# Altium schematic sheet Ethernet.SchDoc
size 381 x 241 mm; SheetNumber: 3; SheetTotal: 4; SPICEModelCacheIATZBDIJ: <root> / <DocumentId>IATZBDIJ</DocumentId> / </root>
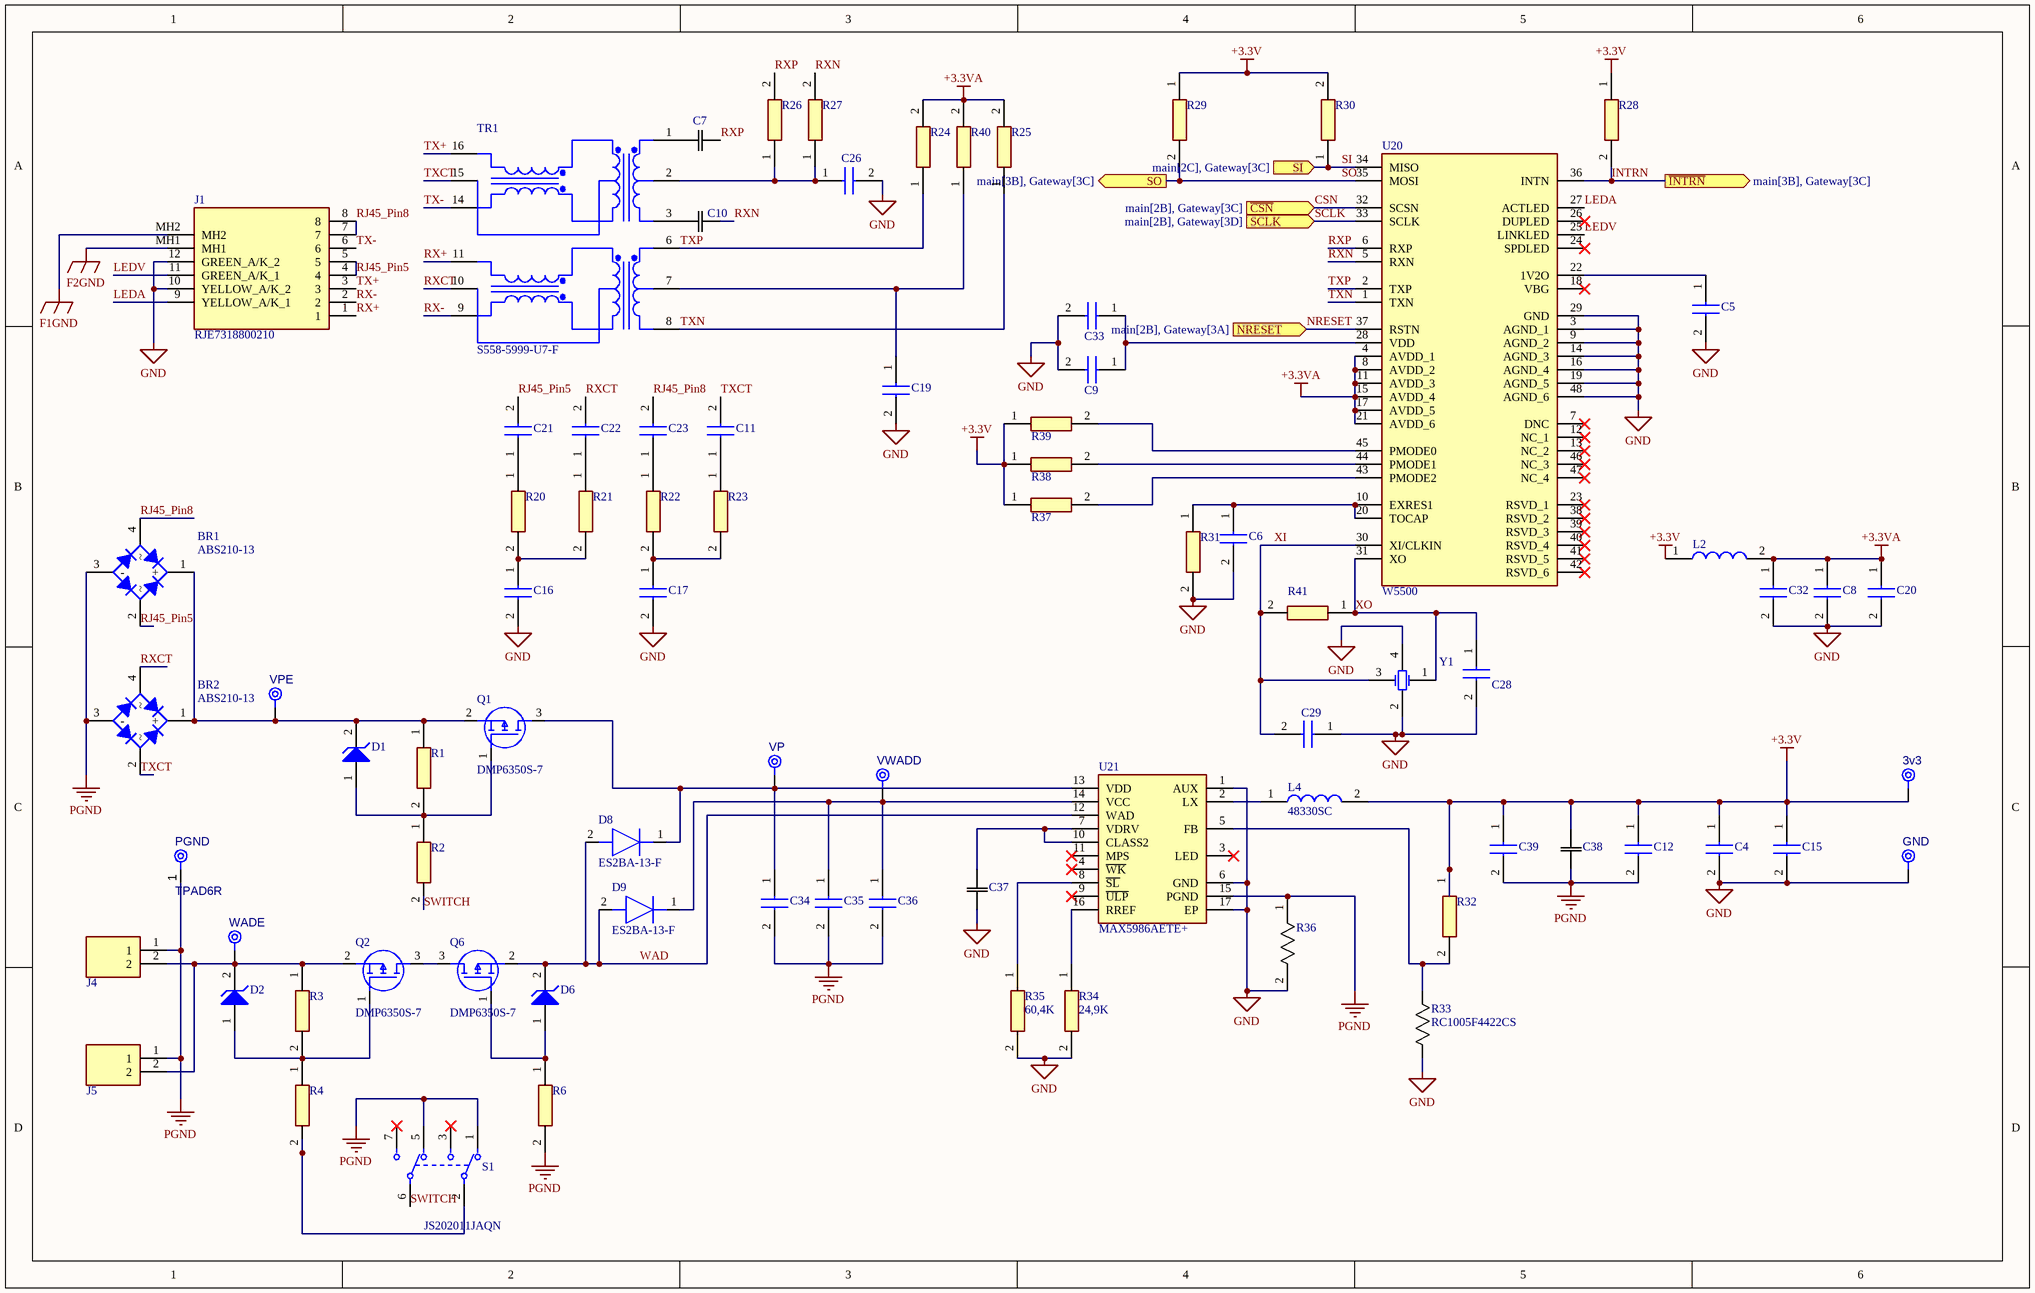
[diagram p0: Ethernet.SchDoc]

## Parts
3v3  TPAD6R  [TP06R]  (value not drawn)  (no BOM)
BR1  ABS210-13  [ABS21013]
BR2  ABS210-13  [ABS21013]
C4  C1005X7R1C104KT  [CAPC1005X55N]  (value not drawn)
C5  CL05B103KO5NNNC  [CAPC1005X55N]  (value not drawn)
C6  JMK105BC6475MV-F  [CAPC1006X65N]  (value not drawn)
C7  CL05X105KP5NNNC  [CAP_CL05_SAM]  (value not drawn)
C8  C1005X7R1C104KT  [CAPC1005X55N]  (value not drawn)
C9  C1005X7R1C104KT  [CAPC1005X55N]  (value not drawn)
C10  CL05X105KP5NNNC  [CAP_CL05_SAM]  (value not drawn)
C11  C1608JB2A223M080AA  [C1608_Commercial]  (value not drawn)
C12  C1005X7R1C104KT  [CAPC1005X55N]  (value not drawn)
C15  CL05A106MP8NUB8  [CAPC1005X90N]  (value not drawn)
C16  CL31B102KJHNNNE  [CAPC3216X180N]  (value not drawn)
C17  CL31B102KJHNNNE  [CAPC3216X180N]  (value not drawn)
C19  GRM155R71H223KA12D  [GRM15x]  (value not drawn)
C20  CL05B103KO5NNNC  [CAPC1005X55N]  (value not drawn)
C21  C1608JB2A223M080AA  [C1608_Commercial]  (value not drawn)
C22  C1608JB2A223M080AA  [C1608_Commercial]  (value not drawn)
C23  C1608JB2A223M080AA  [C1608_Commercial]  (value not drawn)
C26  C1005X5R1E104K050BC  [CAPC1005X55N]  (value not drawn)
C28  C1005C0G1H150JT  [CAPC1005X55N]  (value not drawn)
C29  C1005C0G1H150JT  [CAPC1005X55N]  (value not drawn)
C32  JMK105BC6475MV-F  [CAPC1006X65N]  (value not drawn)
C33  JMK105BC6475MV-F  [CAPC1006X65N]  (value not drawn)
C34  CC0805KKX7R0BB683  [CAPC2012X145N]  (value not drawn)
C35  CL21Y105KCYVPNE  [CAPC2012X145N]  (value not drawn)
C36  GRM32ER71J106KA12L  [CAPC3225X270N]  (value not drawn)
C37  CL05X105KP5NNNC  [CAP_CL_05_SAM]  (value not drawn)
C38  CL05X105KP5NNNC  [CAP_CL_05_SAM]  (value not drawn)
C39  GRM21BR61A476ME15L  [CAPC2012X145N]  (value not drawn)
D1  MMSZ5240B-7-F  [SOD3716X145N]  (value not drawn)
D2  MMSZ5240B-7-F  [SOD3716X145N]  (value not drawn)
D6  MMSZ5240B-7-F  [SOD3716X145N]  (value not drawn)
D8  ES2BA-13-F  [DIOM5226X230N]
D9  ES2BA-13-F  [DIOM5226X230N]
GND  TPAD6R  [TP06R]  (value not drawn)  (no BOM)
J1  RJE7318800210  [RJE7318800210]
J4  OQ0232510000G  [OQ0232510000G]  (value not drawn)
J5  OQ0232510000G  [OQ0232510000G]  (value not drawn)
L2  FBMH1608HM101-T  [INDC1608X90N]  (value not drawn)
L4  48330SC  [48101SC]
PGND  TPAD6R  [TP06R]  (no BOM)
Q1  DMP6350S-7  [SOT96P240X110-3N]
Q2  DMP6350S-7  [SOT96P240X110-3N]
Q6  DMP6350S-7  [SOT96P240X110-3N]
R1  R0402_1%_100_K__RC0402FR-07100KL_  [RESC1005X40N]  (value not drawn)
R2  R0402_1%_100_K__RC0402FR-07100KL_  [RESC1005X40N]  (value not drawn)
R3  R0402_1%_100_K__RC0402FR-07100KL_  [RESC1005X40N]  (value not drawn)
R4  R0402_1%_100_K__RC0402FR-07100KL_  [RESC1005X40N]  (value not drawn)
R6  R0402_1%_100_K__RC0402FR-07100KL_  [RESC1005X40N]  (value not drawn)
R20  RC0603FR-0775RL  [RESC1608X55N]  (value not drawn)
R21  RC0603FR-0775RL  [RESC1608X55N]  (value not drawn)
R22  RC0603FR-0775RL  [RESC1608X55N]  (value not drawn)
R23  RC0603FR-0775RL  [RESC1608X55N]  (value not drawn)
R24  RC0402FR-0749R9L  [RESC1005X40N]  (value not drawn)
R25  RC0402FR-0749R9L  [RESC1005X40N]  (value not drawn)
R26  RC0402FR-0782RL  [RESC1005X40N]  (value not drawn)
R27  RC0402FR-0782RL  [RESC1005X40N]  (value not drawn)
R28  RC0402FR-074K7L  [RESC1005X40N]  (value not drawn)
R29  RC0402FR-074K7L  [RESC1005X40N]  (value not drawn)
R30  RC0402FR-074K7L  [RESC1005X40N]  (value not drawn)
R31  RC0402FR-0712K4L  [RESC1005X40N]  (value not drawn)
R32  RC0402FR-0775KL  [RESC1005X40N]  (value not drawn)
R33  RC1005F4422CS  [RES_1005_SAM-M]
R34  value 24,9K  [RESC1005X40N]  (hidden comment: RC0402FR-0724K9L)
R35  value 60,4K  [RESC1005X40N]  (hidden comment: RC0402FR-0760K4L)
R36  RC0805JR-070RL  [CAPC2012X60N]  (value not drawn)
R37  RC0402FR-0710KL  [RESC1005X40N]  (value not drawn)
R38  RC0402FR-0710KL  [RESC1005X40N]  (value not drawn)
R39  RC0402FR-0710KL  [RESC1005X40N]  (value not drawn)
R40  RC0402FR-0710RL  [RESC1005X40N]  (value not drawn)
R41  RC0402FR-071ML  [RESC1005X40N]  (value not drawn)
S1  JS202011JAQN  [C&K_0_MFG]
TR1  S558-5999-U7-F  [SOIC127P920X571-16N]
U20  W5500  [QFP50P900X900X160-48N]
U21  MAX5986AETE+  [QFN80P500X500X80-17N]
VP  TPAD6R  [TP06R]  (value not drawn)  (no BOM)
VPE  TPAD6R  [TP06R]  (value not drawn)  (no BOM)
VWADD  TPAD6R  [TP06R]  (value not drawn)  (no BOM)
WADE  TPAD6R  [TP06R]  (value not drawn)  (no BOM)
Y1  RH100-25.000-12-F-1010-TR  [RH1002500012F1010TR]  (value not drawn)

## Ports
NRESET (in, see main[2B], Gateway[3A]), SCLK (in, see main[2B], Gateway[3D]), SI (in, see main[2C], Gateway[3C]), SO (out, see main[3B], Gateway[3C]), ~{CSN} (in, see main[2B], Gateway[3C]), ~{INTRN} (out, see main[3B], Gateway[3C])

## Nets
+3.3V: 3v3.1(TP) C4.1 C12.1 C15.1 C38.2 C39.1 L2.1 L4.2 R28.1 R29.1 R30.2 R32.1 R37.1 R38.1 R39.1
+3.3VA: C8.1 C20.1 C32.1 L2.2 R24.2 R25.2 R40.2 U20.4(AVDD_1) U20.8(AVDD_2) U20.11(AVDD_3) U20.15(AVDD_4) U20.17(AVDD_5) U20.21(AVDD_6)
F1GND: J1.MH2
F2GND: J1.MH1
GND: C4.2 C5.2 C6.2 C8.2 C9.2 C15.2 C16.2 C17.2 C19.2 C20.2 C26.2 C28.2 C29.1 C32.2 C33.2 C37.1 GND.1(TP) J1.10(YELLOW_A/K_2) J1.12(GREEN_A/K_2) R31.2 R33.1 R34.2 R35.2 R36.2 U20.3(AGND_1) U20.9(AGND_2) U20.14(AGND_3) U20.16(AGND_4) U20.19(AGND_5) U20.29(GND) U20.48(AGND_6) U21.1(AUX) U21.6(GND) U21.17(EP) Y1.2(NC_1) Y1.4(NC_2)
PGND: BR1.3(-) BR2.3(-) C12.2 C34.2 C35.2 C36.2 C38.1 C39.2 J4.1 J5.1 PGND.1(TP) R6.2 R36.1 S1.1 S1.5 U21.15(PGND)
CSN: U20.32(SCSN) ; port ~{CSN}
INTRN: R28.2 U20.36(INTN) ; port ~{INTRN}
LEDA: J1.9(YELLOW_A/K_1) U20.27(ACTLED)
LEDV: J1.11(GREEN_A/K_1) U20.25(LINKLED)
NRESET: U20.37(RSTN) ; port NRESET
RJ45_Pin5: BR1.2 C21.2 J1.4 J1.5
RJ45_Pin8: BR1.4 C23.2 J1.7 J1.8
RX+: J1.1 TR1.11(RX+)
RX-: J1.2 TR1.9(RX-)
RXCT: BR2.4 C22.2 TR1.10(RXCT)
RXN: C10.2 R27.2 U20.5(RXN)
RXP: C7.2 R26.2 U20.6(RXP)
SCLK: U20.33(SCLK) ; port SCLK
SI: R30.1 U20.34(MISO) ; port SI
SO: R29.2 U20.35(MOSI) ; port SO
SWITCH: R2.2 S1.6(2_C)
TX+: J1.3 TR1.16(TX+)
TX-: J1.6 TR1.14(TX-)
TXCT: BR2.2 C11.2 TR1.15(TXCT)
TXN: R25.1 TR1.8(RD-) U20.1(TXN)
TXP: R24.1 TR1.6(RD+) U20.2(TXP)
WAD: D6.2(A) D8.2(A) D9.2(A) Q6.2(S) U21.12(WAD)
XI: C29.2 R41.2 U20.30(XI/CLKIN) Y1.3(CRYSTAL_2)
XO: C28.1 R41.1 U20.31(XO) Y1.1(CRYSTAL_1)
NetBR1_1: BR1.1(+) BR2.1(+) D1.2(A) Q1.2(S) R1.1 VPE.1(TP)
NetC5_1: C5.1 U20.22(1V2O)
NetC6_1: C6.1 R31.1 U20.10(EXRES1) U20.20(TOCAP)
NetC7_1: C7.1 TR1.1(TD+)
NetC9_1: C9.1 C33.1 U20.28(VDD)
NetC10_1: C10.1 TR1.3(TD-)
NetC11_1: C11.1 R23.1
NetC16_1: C16.1 R20.2 R21.2
NetC17_1: C17.1 R22.2 R23.2
NetC19_1: C19.1 R40.1 TR1.7(RDCT)
NetC21_1: C21.1 R20.1
NetC22_1: C22.1 R21.1
NetC23_1: C23.1 R22.1
NetC26_1: C26.1 R26.1 R27.1 TR1.2(TDCT)
NetC34_1: C34.1 D8.1(K) Q1.3(D) U21.13(VDD) VP.1(TP)
NetC35_1: C35.1 C36.1 D9.1(K) U21.14(VCC) VWADD.1(TP)
NetC37_2: C37.2 U21.7(VDRV) U21.10(CLASS2)
NetD1_1: D1.1(K) Q1.1(G) R1.2 R2.1
NetD2_1: D2.1(K) Q2.1(G) R3.2 R4.1
NetD2_2: D2.2(A) J4.2 J5.2 Q2.2(S) R3.1 WADE.1(TP)
NetD6_1: D6.1(K) Q6.1(G) R6.1
NetL4_1: L4.1 U21.2(LX)
NetQ2_3: Q2.3(D) Q6.3(D)
NetR4_2: R4.2 S1.2(1_C)
NetR32_2: R32.2 R33.2 U21.5(FB)
NetR34_1: R34.1 U21.16(RREF)
NetR35_1: R35.1 U21.8(~{SL})
NetR37_2: R37.2 U20.43(PMODE2)
NetR38_2: R38.2 U20.44(PMODE1)
NetR39_2: R39.2 U20.45(PMODE0)

Not connected (* = marked no-connect by the designer): S1 3* 7*; U20 7(DNC)* 12(NC_1)* 13(NC_2)* 18(VBG)* 23(RSVD_1)* 24(SPDLED)* 26(DUPLED)* 38(RSVD_2)* 39(RSVD_3)* 40(RSVD_4)* 41(RSVD_5)* 42(RSVD_6)* 46(NC_3)* 47(NC_4)*; U21 3(LED)* 4(~{WK})* 9(~{ULP})* 11(MPS)*

## Library data of the parts
3v3 GND PGND VP VPE VWADD WADE = CMP-00028-00002-2: 0.6mm round; Pins: 1
BR1 BR2 = ABS210-13: Bridge Rectifier; Manufacturer_Name: Diodes Incorporated; Datasheet Link: https://www.diodes.com/assets/Datasheets/ABS210.pdf; Height: 1.7mm; Manufacturer_Part_Number: ABS210-13; Mouser Part Number: 621-ABS210-13; Mouser Price/Stock: https://www.mouser.co.uk/ProductDetail/Diodes-Incorporated/ABS210-13?qs=5aG0NVq1C4xM%2FxRR9dyQBQ%3D%3D; Arrow Part Number: ABS210-13; Arrow Price/Stock: https://www.arrow.com/en/products/abs210-13/diodes-incorporated?region=nac
C4 C12 = C1005X7R1C104KT: Capacitor; Manufacturer_Name: TDK; Datasheet Link: https://product.tdk.com/en/system/files?file=dam/doc/product/capacitor/ceramic/mlcc/specification/mlccspec_commercial_general_midvoltage_en.pdf; Height: 0.55mm; Manufacturer_Part_Number: C1005X7R1C104KT; Mouser Part Number: N/A; Mouser Price/Stock: https://www.mouser.co.uk/ProductDetail/TDK/C1005X7R1C104KT?qs=cdpe0LUyr8DJnVp5QbU7dQ%3D%3D
C5 C20 = CL05B103KO5NNNC: Capacitor 10n; Manufacturer_Name: SAMSUNG; Datasheet Link: https://mouser.componentsearchengine.com/Datasheets/2/CL05B103KO5NNNC.pdf; Height: 0.55mm; Manufacturer_Part_Number: CL05B103KO5NNNC; Mouser Part Number: N/A; Mouser Price/Stock: https://www.mouser.co.uk/ProductDetail/Samsung-Electro-Mechanics/CL05B103KO5NNNC?qs=349EhDEZ59r%252BGo7Nl8uX3w%3D%3D; Arrow Part Number: CL05B103KO5NNNC; Arrow Price/Stock: https://www.arrow.com/en/products/cl05b103ko5nnnc/samsung-electro-mechanics
C6 C32 C33 = JMK105BC6475MV-F: Capacitor 4,7u; Manufacturer_Name: TAIYO YUDEN; Datasheet Link: https://componentsearchengine.com/Datasheets/2/JMK105BC6475MV-F.pdf; Height: 0.65mm; Manufacturer_Part_Number: JMK105BC6475MV-F; Mouser Part Number: 963-JMK105BC6475MV-F; Mouser Price/Stock: https://www.mouser.co.uk/ProductDetail/Taiyo-Yuden/JMK105BC6475MV-F?qs=drgMNd%252BkGPOdMbU7ypNm%2FA%3D%3D
C7 C10 C38 = CL05X105KP5NNNC: No Description Available; Mfr_Name: Samsung
C8 C9 = C1005X7R1C104KT: Capacitor 100n; Manufacturer_Name: TDK; Datasheet Link: https://product.tdk.com/en/system/files?file=dam/doc/product/capacitor/ceramic/mlcc/specification/mlccspec_commercial_general_midvoltage_en.pdf; Height: 0.55mm; Manufacturer_Part_Number: C1005X7R1C104KT; Mouser Part Number: N/A; Mouser Price/Stock: https://www.mouser.co.uk/ProductDetail/TDK/C1005X7R1C104KT?qs=cdpe0LUyr8DJnVp5QbU7dQ%3D%3D
C11 C21-C23 = C1608JB2A223M080AA: Capacitor; Manufacturer_Name: TDK; Datasheet Link: https://product.tdk.com/system/files/dam/doc/product/capacitor/ceramic/mlcc/catalog/mlcc_commercial_midvoltage_en.pdf; Height: 0.9mm; Manufacturer_Part_Number: C1608JB2A223M080AA; Mouser Part Number: 810-C1608JB2A223M08A; Mouser Price/Stock: https://www.mouser.co.uk/ProductDetail/TDK/C1608JB2A223M080AA?qs=xLDY6iXSiQb47Cqd%252BoHJag%3D%3D
C15 = CL05A106MP8NUB8: Capacitor 10u; Manufacturer_Name: SAMSUNG; Datasheet Link: https://datasheet.datasheetarchive.com/originals/distributors/DKDS-19/372904.pdf; Height: 0.9mm; Manufacturer_Part_Number: CL05A106MP8NUB8; Mouser Part Number: 187-CL05A106MP8NUB8; Mouser Price/Stock: https://www.mouser.co.uk/ProductDetail/Samsung-Electro-Mechanics/CL05A106MP8NUB8?qs=W0yvOO0ixfHmpNLt1Po66A%3D%3D; Arrow Part Number: CL05A106MP8NUB8; Arrow Price/Stock: https://www.arrow.com/en/products/cl05a106mp8nub8/samsung-electro-mechanics?region=nac
C16 C17 = CL31B102KJHNNNE: Capacitor; Manufacturer_Name: SAMSUNG; Datasheet Link: https://www.tme.com/Document/4a42202b32dab16128fe107dd69598cc/samsung-chip-cap.pdf; Height: 1.8mm; Manufacturer_Part_Number: CL31B102KJHNNNE; Mouser Part Number: 187-CL31B102KJHNNNE; Mouser Price/Stock: https://www.mouser.co.uk/ProductDetail/Samsung-Electro-Mechanics/CL31B102KJHNNNE?qs=X6jEic%2FHinAYVHtIjHgytw%3D%3D; Arrow Part Number: CL31B102KJHNNNE; Arrow Price/Stock: https://www.arrow.com/en/products/cl31b102kjhnnne/samsung-electro-mechanics?region=nac
C19 = GRM155R71H223KA12D: Capacitor; Manufacturer_Name: Murata Electronics; Datasheet Link: https://search.murata.co.jp/Ceramy/image/img/A01X/G101/ENG/GRM155R71H223KA12-01A.pdf; Height: 0.5mm; Manufacturer_Part_Number: GRM155R71H223KA12D; Mouser Part Number: 81-GRM155R71H223KA12; Mouser Price/Stock: https://www.mouser.co.uk/ProductDetail/Murata-Electronics/GRM155R71H223KA12D?qs=Dfh4SrgScWyE65FKEkixtw%3D%3D; Arrow Part Number: GRM155R71H223KA12D; Arrow Price/Stock: https://www.arrow.com/en/products/grm155r71h223ka12d/murata-manufacturing?region=nac
C26 = C1005X5R1E104K050BC: Capacitor; Manufacturer_Name: TDK; Datasheet Link: https://product.tdk.com/info/en/catalog/datasheets/mlcc_commercial_midvoltage_en.pdf; Height: 0.55mm; Manufacturer_Part_Number: C1005X5R1E104K050BC; Mouser Part Number: 810-C1005X5R1E104K; Mouser Price/Stock: https://www.mouser.co.uk/ProductDetail/TDK/C1005X5R1E104K050BC?qs=dfay7wIA1uGgFjZlp3mTxQ%3D%3D; Arrow Part Number: C1005X5R1E104K050BC; Arrow Price/Stock: https://www.arrow.com/en/products/c1005x5r1e104k050bc/tdk
C28 C29 = CC0402JRNPO9BN150: Capacitor 15pF; Manufacturer_Name: YAGEO; Datasheet Link: https://4donline.ihs.com/images/VipMasterIC/IC/YAGO/YAGO-S-A0012506047/YAGO-S-A0012506047-1.pdf?hkey=6D3A4C79FDBF58556ACFDE234799DDF0; Height: 0.55mm; Manufacturer_Part_Number: CC0402JRNPO9BN150
C34 = CC0805KKX7R0BB683: Capacitor 0,068u; Manufacturer_Name: YAGEO; Datasheet Link: https://www.yageo.com/upload/media/product/products/datasheet/mlcc/UPY-NP0X7R_MV_100-to-630V_21.pdf; Height: 1.45mm; Manufacturer_Part_Number: CC0805KKX7R0BB683; Mouser Part Number: 603-CC0805KR0BB683; Mouser Price/Stock: https://www.mouser.co.uk/ProductDetail/YAGEO/CC0805KKX7R0BB683?qs=mzRxyRlhVdtSvrGWLiLEAA%3D%3D
C35 = CL21Y105KCYVPNE: Capacitor; Manufacturer_Name: SAMSUNG; Datasheet Link: https://product.samsungsem.com/mlcc/basic-search.do?partNumber=CL21Y105KCYVPN; Height: 1.45mm; Manufacturer_Part_Number: CL21Y105KCYVPNE
C36 = GRM32ER71J106KA12L: Capacitor 10u; Manufacturer_Name: Murata Electronics; Datasheet Link: http://psearch.en.murata.com/capacitor/product/GRM32ER71E226KE15%23.pdf; Height: 2.7mm; Manufacturer_Part_Number: GRM32ER71J106KA12L; Mouser Part Number: 81-GRM32ER71J106KA2L; Mouser Price/Stock: https://www.mouser.co.uk/ProductDetail/Murata-Electronics/GRM32ER71J106KA12L?qs=eeBpzGFlv%252B%2FlkjOiPI7fBw%3D%3D; Arrow Part Number: GRM32ER71J106KA12L; Arrow Price/Stock: https://www.arrow.com/en/products/grm32er71j106ka12l/murata-manufacturing?region=nac
C37 = CL05X105KP5NNNC: 1u; Mfr_Name: Samsung
C39 = GRM21BR61A476ME15L: Capacitor; Manufacturer_Name: Murata Electronics; Datasheet Link: http://www.murata.com/~/media/webrenewal/support/library/catalog/products/capacitor/mlcc/c02e.pdf; Height: 1.45mm; Manufacturer_Part_Number: GRM21BR61A476ME15L; Mouser Part Number: 81-GRM21BR61A476ME5L; Mouser Price/Stock: https://www.mouser.co.uk/ProductDetail/Murata-Electronics/GRM21BR61A476ME15L?qs=hNud%2FORuBR2%2FEB7WUpdltg%3D%3D; Arrow Part Number: GRM21BR61A476ME15L; Arrow Price/Stock: https://www.arrow.com/en/products/grm21br61a476me15l/murata-manufacturing?region=nac
D1 D2 D6 = MMSZ5240B-7-F: D2; Manufacturer_Name: Diodes Incorporated; Datasheet Link: https://www.diodes.com//assets/Datasheets/ds18010.pdf; Height: 1.45mm; Manufacturer_Part_Number: MMSZ5240B-7-F; Mouser Part Number: 621-MMSZ5240B-F; Mouser Price/Stock: https://www.mouser.co.uk/ProductDetail/Diodes-Incorporated/MMSZ5240B-7-F?qs=t7uQ6EWLCAAZaK0TvRbq0A%3D%3D; Arrow Part Number: MMSZ5240B-7-F; Arrow Price/Stock: https://www.arrow.com/en/products/mmsz5240b-7-f/diodes-incorporated?region=nac
D8 D9 = ES2BA-13-F: Diode; Manufacturer_Name: Diodes Incorporated; Datasheet Link: https://www.diodes.com/assets/Datasheets/ds14002.pdf; Height: 2.3mm; Manufacturer_Part_Number: ES2BA-13-F; Mouser Part Number: 621-ES2BA-F; Mouser Price/Stock: https://www.mouser.co.uk/ProductDetail/Diodes-Incorporated/ES2BA-13-F?qs=VEnr2Ndo2sLuOIbJ1qj2iA%3D%3D; Arrow Part Number: ES2BA-13-F; Arrow Price/Stock: https://www.arrow.com/en/products/es2ba-13-f/diodes-incorporated?region=nac
J1 = RJE7318800210: Connector; Manufacturer_Name: Amphenol Communications Solutions; Datasheet Link: https://cdn.amphenol-cs.com/media/wysiwyg/files/drawing/rje7318800xxx0x.pdf; Height: 11.25mm; Manufacturer_Part_Number: RJE7318800210; Mouser Part Number: 523-RJE7318800210; Mouser Price/Stock: https://www.mouser.co.uk/ProductDetail/Amphenol-Commercial-Products/RJE7318800210?qs=vNmQ2AR%252BfFXMNLPGGmTUSA%3D%3D; Arrow Part Number: RJE7318800210; Arrow Price/Stock: https://www.arrow.com/en/products/rje7318800210/amphenol
J4 J5 = OQ0232510000G: Connector; Manufacturer_Name: Amphenol; Datasheet Link: https://datasheet.datasheetarchive.com/originals/distributors/DKDS-11/219802.pdf; Height: 7.5mm; Manufacturer_Part_Number: OQ0232510000G; Mouser Part Number: 649-220110-D021A01LF; Mouser Price/Stock: https://www.mouser.co.uk/ProductDetail/Amphenol-Anytek/OQ0232510000G?qs=Mv7BduZupUhls3kYL4ZmhA%3D%3D; Arrow Part Number: OQ0232510000G; Arrow Price/Stock: https://www.arrow.com/en/products/oq0232510000g/amphenol?region=nac
L2 = FBMH1608HM101-T: Ferrite Bead; Manufacturer_Name: TAIYO YUDEN; Datasheet Link: https://ds.yuden.co.jp/TYCOMPAS/ut/detail?pn=FBMH1608HM101-T  &u=M; Height: 0.9mm; Manufacturer_Part_Number: FBMH1608HM101-T; Mouser Part Number: 963-FBMH1608HM101-T; Mouser Price/Stock: https://www.mouser.co.uk/ProductDetail/TAIYO-YUDEN/FBMH1608HM101-T?qs=I6KAKw0tg2x7mZxNTOSJ2Q%3D%3D; Arrow Part Number: FBMH1608HM101-T; Arrow Price/Stock: https://www.arrow.com/en/products/fbmh1608hm101-t/taiyo-yuden?region=nac
L4 = 48101SC: Inductor; Manufacturer_Name: Murata Electronics; Datasheet Link: https://datasheet.datasheetarchive.com/originals/distributors/Datasheets_SAMA/421810913ab0fa5fe67b295e06f329e3.pdf; Height: 6mm; Manufacturer_Part_Number: 48101SC; Mouser Part Number: 580-48101SC; Mouser Price/Stock: https://www.mouser.co.uk/ProductDetail/Murata-Power-Solutions/48101SC?qs=ocmcTMnGEDjPRa4zRiyoIQ%3D%3D; Arrow Part Number: 48101SC; Arrow Price/Stock: https://www.arrow.com/en/products/48101sc/murata-power-solutions?region=nac
Q1 Q2 Q6 = DMP6350S-7: MOSFET (P-Channel); Manufacturer_Name: Diodes Incorporated; Datasheet Link: https://www.diodes.com//assets/Datasheets/DMP6350S.pdf; Height: 1.1mm; Manufacturer_Part_Number: DMP6350S-7; Mouser Part Number: 621-DMP6350S-7; Mouser Price/Stock: https://www.mouser.co.uk/ProductDetail/Diodes-Incorporated/DMP6350S-7?qs=rN85NNvew%2FSA9agMyymcZg%3D%3D; Arrow Part Number: DMP6350S-7; Arrow Price/Stock: https://www.arrow.com/en/products/dmp6350s-7/diodes-incorporated?utm_currency=USD&region=nac
R1-R4 R6 = R0402_1%_100_K__RC0402FR-07100KL_: Resistor 100k; Manufacturer_Name: YAGEO; Manufacturer_Part_Number: R0402 1% 100 K (RC0402FR-07100KL); Datasheet Link: https://www.yageo.com/upload/media/product/products/datasheet/rchip/PYu-RC_Group_51_RoHS_L_12.pdf; Height: 0.4mm
R20-R23 = RC0603FR-0775RL: Resistor; Manufacturer_Name: KEMET; Datasheet Link: http://www.yageo.com/documents/recent/PYu-RC0603_51_RoHS_L_v5.pdf; Height: 0.55mm; Manufacturer_Part_Number: RC0603FR-0775RL; Mouser Part Number: 603-RC0603FR-0775RL; Mouser Price/Stock: https://www.mouser.co.uk/ProductDetail/YAGEO/RC0603FR-0775RL?qs=NEN%2FsE%2FLsvOyCMLfQoUEYg%3D%3D; Arrow Part Number: RC0603FR-0775RL; Arrow Price/Stock: https://www.arrow.com/en/products/rc0603fr-0775rl/yageo?region=europe
R24 R25 = RC0402FR-0749R9L: Resistor 49,9 ohms; Manufacturer_Name: YAGEO; Datasheet Link: https://www.yageo.com/upload/media/product/productsearch/datasheet/rchip/PYu-RC_Group_51_RoHS_L_12.pdf; Height: 0.4mm; Manufacturer_Part_Number: RC0402FR-0749R9L; Mouser Part Number: 603-RC0402FR-0749R9L; Mouser Price/Stock: https://www.mouser.co.uk/ProductDetail/YAGEO/RC0402FR-0749R9L?qs=lywS2nZzkrJ8zCaO%252B%252Bic5Q%3D%3D; Arrow Part Number: RC0402FR-0749R9L; Arrow Price/Stock: https://www.arrow.com/en/products/rc0402fr-0749r9l/yageo?region=nac
R26 R27 = RC0402FR-0782RL: Resistor; Manufacturer_Name: KEMET; Datasheet Link: http://www.yageo.com/documents/recent/PYu-RC0402_51_RoHS_L_6_r.pdf; Height: 0.4mm; Manufacturer_Part_Number: RC0402FR-0782RL; Mouser Part Number: 603-RC0402FR-0782RL; Mouser Price/Stock: https://www.mouser.com/Search/Refine.aspx?Keyword=603-RC0402FR-0782RL
R28 R29 = RC0402FR-074K7L: Resistor 4,7K; Manufacturer_Name: KEMET; Datasheet Link: http://www.yageo.com/documents/recent/PYu-RC0402_51_RoHS_L_6_r.pdf; Height: 0.4mm; Manufacturer_Part_Number: RC0402FR-074K7L; Mouser Part Number: 603-RC0402FR-074K7L; Mouser Price/Stock: https://www.mouser.co.uk/ProductDetail/YAGEO/RC0402FR-074K7L?qs=V1yeUXFNrkn%2FmCXC8N8TTA%3D%3D; Arrow Part Number: RC0402FR-074K7L; Arrow Price/Stock: https://www.arrow.com/en/products/rc0402fr-074k7l/yageo
R30 = RC0402FR-074K7L: Resistor 4,7 K; Manufacturer_Name: KEMET; Datasheet Link: http://www.yageo.com/documents/recent/PYu-RC0402_51_RoHS_L_6_r.pdf; Height: 0.4mm; Manufacturer_Part_Number: RC0402FR-074K7L; Mouser Part Number: 603-RC0402FR-074K7L; Mouser Price/Stock: https://www.mouser.co.uk/ProductDetail/YAGEO/RC0402FR-074K7L?qs=V1yeUXFNrkn%2FmCXC8N8TTA%3D%3D; Arrow Part Number: RC0402FR-074K7L; Arrow Price/Stock: https://www.arrow.com/en/products/rc0402fr-074k7l/yageo
R31 = RC0402FR-0712K4L: Resistor 12,4K; Manufacturer_Name: KEMET; Datasheet Link: http://www.yageo.com/documents/recent/PYu-RC0402_51_RoHS_L_6_r.pdf; Height: 0.4mm; Manufacturer_Part_Number: RC0402FR-0712K4L; Mouser Part Number: 603-RC0402FR-0712K4L; Mouser Price/Stock: https://www.mouser.co.uk/ProductDetail/Yageo/RC0402FR-0712K4L?qs=V1yeUXFNrkm%2FqL2k6A7hug%3D%3D; Arrow Part Number: RC0402FR-0712K4L; Arrow Price/Stock: https://www.arrow.com/en/products/rc0402fr-0712k4l/yageo
R32 = RC0402FR-0775KL: Resistor; Manufacturer_Name: KEMET; Datasheet Link: http://www.yageo.com/documents/recent/PYu-RC0402_51_RoHS_L_6_r.pdf; Height: 0.4mm; Manufacturer_Part_Number: RC0402FR-0775KL; Mouser Part Number: 603-RC0402FR-0775KL; Mouser Price/Stock: https://www.mouser.com/Search/Refine.aspx?Keyword=603-RC0402FR-0775KL; Arrow Part Number: RC0402FR-0775KL; Arrow Price/Stock: https://www.arrow.com/en/products/rc0402fr-0775kl/yageo
R33 = RC1005F4422CS: No Description Available; Mfr_Name: Samsung
R34 = RC0402FR-0724K9L: Resistor; Manufacturer_Name: KEMET; Datasheet Link: http://www.yageo.com/documents/recent/PYu-RC0402_51_RoHS_L_6_r.pdf; Height: 0.4mm; Manufacturer_Part_Number: RC0402FR-0724K9L; Mouser Part Number: 603-RC0402FR-0724K9L; Mouser Price/Stock: http://www.mouser.com/Search/ProductDetail.aspx?qs=QT1cPpUoD8G4814z3vi3ew%3d%3d
R35 = RC0402FR-0760K4L: Resistor 60,4K; Manufacturer_Name: KEMET; Datasheet Link: http://www.yageo.com/documents/recent/PYu-RC0402_51_RoHS_L_6_r.pdf; Height: 0.4mm; Manufacturer_Part_Number: RC0402FR-0760K4L; Mouser Part Number: 603-RC0402FR-0760K4L; Mouser Price/Stock: https://www.mouser.com/Search/Refine.aspx?Keyword=603-RC0402FR-0760K4L; Arrow Part Number: RC0402FR-0760K4L; Arrow Price/Stock: https://www.arrow.com/en/products/rc0402fr-0760k4l/yageo
R36 = RC0805JR-070RL: Capacitor 0 ohms; Manufacturer_Name: YAGEO; Datasheet Link: https://www.yageo.com/upload/media/product/productsearch/datasheet/rchip/PYu-RC_Group_51_RoHS_L_12.pdf; Height: 0.6mm; Manufacturer_Part_Number: RC0805JR-070RL; Mouser Part Number: 603-RC0805JR-070RL; Mouser Price/Stock: https://www.mouser.co.uk/ProductDetail/YAGEO/RC0805JR-070RL?qs=3ldFlDWnkKyEhdaPjQHEFA%3D%3D; Arrow Part Number: RC0805JR-070RL; Arrow Price/Stock: null?region=nac
R37-R39 = RC0402FR-0710KL: Resistor 10K; Manufacturer_Name: YAGEO; Datasheet Link: https://componentsearchengine.com/Datasheets/2/RC0402FR-0710KL.pdf; Height: 0.4mm; Manufacturer_Part_Number: RC0402FR-0710KL; Mouser Part Number: 603-RC0402FR-0710KL; Mouser Price/Stock: https://www.mouser.co.uk/ProductDetail/YAGEO/RC0402FR-0710KL?qs=I1mnnYJTTsxUoNwrUsQExA%3D%3D; Arrow Part Number: RC0402FR-0710KL; Arrow Price/Stock: https://www.arrow.com/en/products/rc0402fr-0710kl/yageo?region=europe
R40 = RC0402FR-0710RL: Resistor 10 ohms; Manufacturer_Name: YAGEO; Datasheet Link: https://www.mouser.cn/datasheet/2/447/YAGEO_PYu_RC_Group_51_RoHS_L_12-3313492.pdf; Height: 0.4mm; Manufacturer_Part_Number: RC0402FR-0710RL; Mouser Part Number: 603-RC0402FR-0710RL; Mouser Price/Stock: https://www.mouser.co.uk/ProductDetail/YAGEO/RC0402FR-0710RL?qs=V1yeUXFNrkkzkWCUUWS9og%3D%3D; Arrow Part Number: RC0402FR-0710RL; Arrow Price/Stock: https://www.arrow.com/en/products/rc0402fr-0710rl/yageo?region=europe
R41 = RC0402FR-071ML: Resistor 1M; Manufacturer_Name: YAGEO; Datasheet Link: https://componentsearchengine.com/Datasheets/2/RC0402FR-071ML.pdf; Height: 0.4mm; Manufacturer_Part_Number: RC0402FR-071ML; Mouser Part Number: 603-RC0402FR-071ML; Mouser Price/Stock: https://www.mouser.co.uk/ProductDetail/YAGEO/RC0402FR-071ML?qs=V1yeUXFNrknfoI4987wfBQ%3D%3D; Arrow Part Number: RC0402FR-071ML; Arrow Price/Stock: https://www.arrow.com/en/products/rc0402fr-071ml/yageo?region=nac
TR1 = S558-5999-U7-F: Integrated Circuit; Manufacturer_Name: BelFuse; Datasheet Link: https://datasheet.datasheetarchive.com/originals/distributors/Datasheets_SAMA/db0cb1a0bfcf5d4689e4d1da1843e2e3.pdf; Height: 5.71mm; Manufacturer_Part_Number: S558-5999-U7-F; Mouser Part Number: 530-S558-5999-U7-F; Mouser Price/Stock: http://www.mouser.com/Search/ProductDetail.aspx?qs=SRYZG9HaIQ2NmzVD%252bSK3sg%3d%3d; Arrow Part Number: S558-5999-U7-F; Arrow Price/Stock: https://www.arrow.com/en/products/s558-5999-u7-f/bel-group
U20 = W5500: Integrated Circuit; Manufacturer_Name: WIZnet Inc; Datasheet Link: http://wizwiki.net/wiki/lib/exe/fetch.php?media=products:w5500:w5500_ds_v106e_141230.pdf; Height: 1.6mm; Manufacturer_Part_Number: W5500; Mouser Part Number: 950-W5500; Mouser Price/Stock: https://www.mouser.co.uk/ProductDetail/WIZnet/W5500?qs=2vh%252B45pPFtzthUpYPd4pqA%3D%3D
U21 = MAX5986AETE+: Integrated Circuit; Manufacturer_Name: Analog Devices; Datasheet Link: http://www.mouser.com/datasheet/2/256/MAX5986A-MAX5987A-1515698.pdf; Height: 0.8mm; Manufacturer_Part_Number: MAX5986AETE+; Mouser Part Number: 700-MAX5986AETE+; Mouser Price/Stock: https://www.mouser.com/Search/Refine.aspx?Keyword=700-MAX5986AETE%2B; Arrow Part Number: MAX5986AETE+; Arrow Price/Stock: https://www.arrow.com/en/products/max5986aete/analog-devices?utm_currency=USD&region=europe
Y1 = RH100-25.000-12-F-1010-TR: Crystal or Oscillator; Manufacturer_Name: RALTRON; Datasheet Link: https://raltron.com/webproducts/specs/CRYSTAL/RH100-25.000-12-F-1010-TR.pdf; Height: 0.71mm; Manufacturer_Part_Number: RH100-25.000-12-F-1010-TR